# Altium schematic sheet MCU.SchDoc
size A4; SheetNumber: 1; SheetTotal: 4
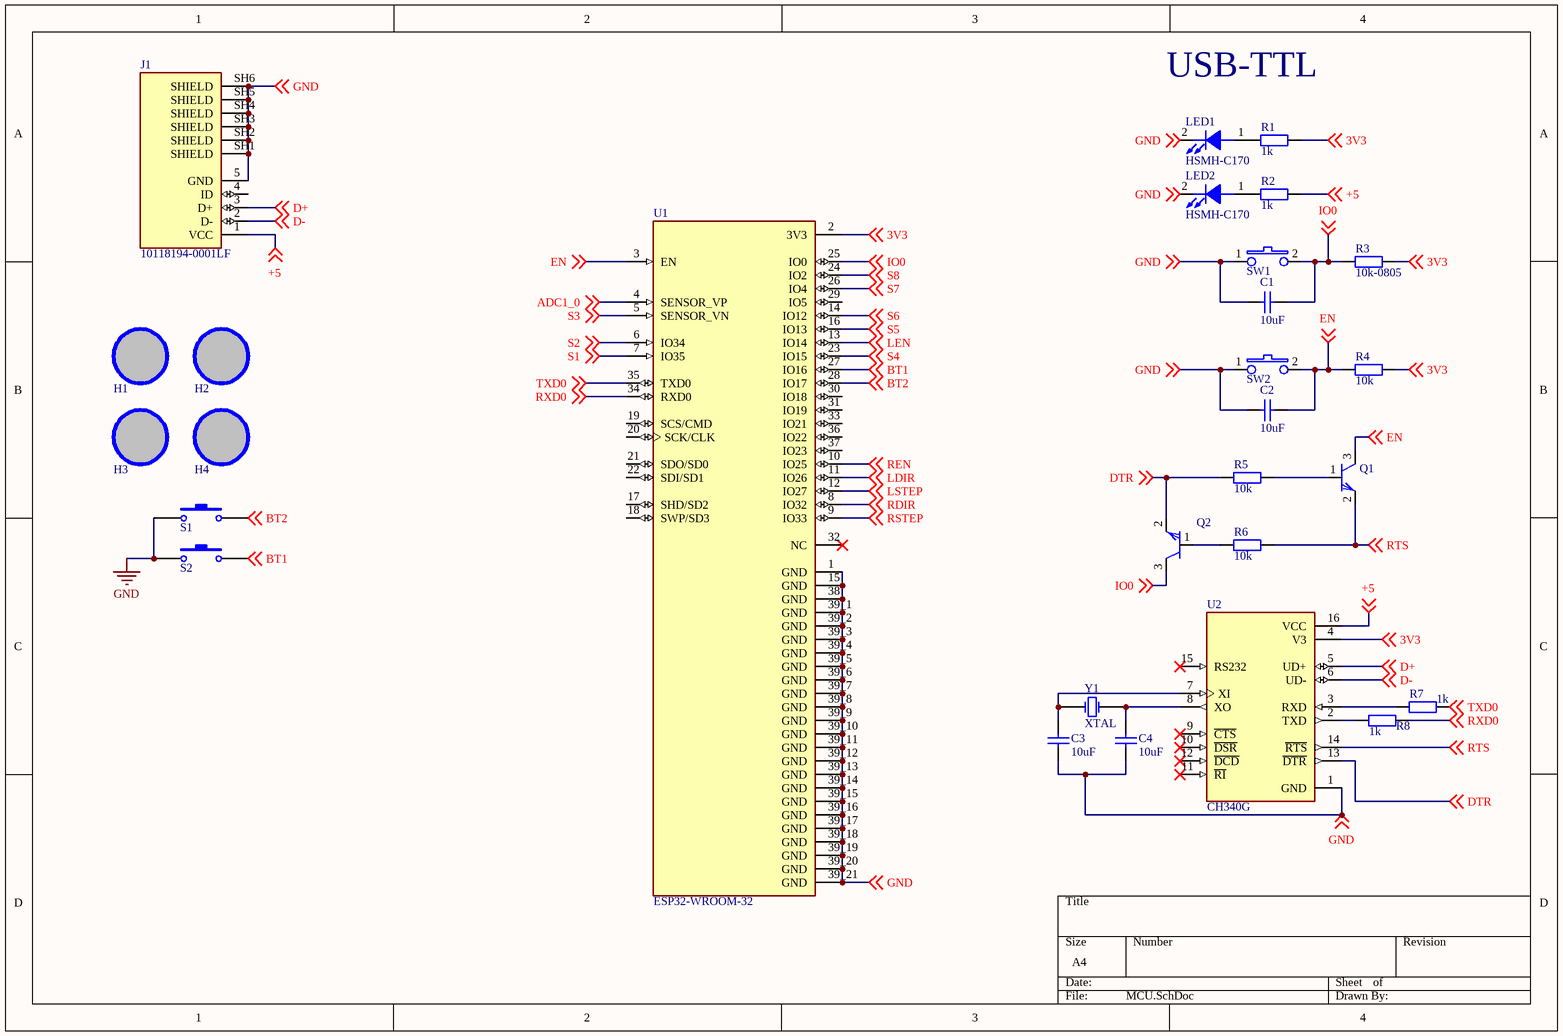
[diagram p0: MCU.SchDoc]

## Parts
C1  value 10uF  [C-NP-0805]  (hidden comment: Cap Non-pol)
C2  value 10uF  [C-NP-0805]  (hidden comment: Cap Non-pol)
C3  value 10uF  [C-NP-0805]  (hidden comment: Cap Non-pol)
C4  value 10uF  [C-NP-0805]  (hidden comment: Cap Non-pol)
H1  Hole  [LO KHOAN 3MM]  (value not drawn)
H2  Hole  [LO KHOAN 3MM]  (value not drawn)
H3  Hole  [LO KHOAN 3MM]  (value not drawn)
H4  Hole  [LO KHOAN 3MM]  (value not drawn)
J1  10118194-0001LF  [AMPHENOL_10118194-0001LF]
LED1  HSMH-C170  [LED.SMD.RED]
LED2  HSMH-C170  [LED.SMD.RED]
Q1  C1815  [SOT23N]  (value not drawn)
Q2  C1815  [SOT23N]  (value not drawn)
R1  value 1k  [DIEN TRO 0805]  (hidden comment: RES_SMD_0805)
R2  value 1k  [DIEN TRO 0805]  (hidden comment: RES_SMD_0805)
R3  value 10k-0805  [DIEN TRO 0805]  (hidden comment: RES_SMD_0805)
R4  value 10k  [DIEN TRO 0805]  (hidden comment: RES_SMD_0805)
R5  value 10k  [DIEN TRO 0805]  (hidden comment: RES_SMD_0805)
R6  value 10k  [DIEN TRO 0805]  (hidden comment: RES_SMD_0805)
R7  value 1k  [DIEN TRO 0805]  (hidden comment: RES_SMD_0805)
R8  value 1k  [DIEN TRO 0805]  (hidden comment: RES_SMD_0805)
S1  Tact SW - 2Pin  [SW2]  (value not drawn)
S2  Tact SW - 2Pin  [SW2]  (value not drawn)
SW1  PTS635  [TactSwitches.PTS635.SMT]  (value not drawn)
SW2  PTS635  [TactSwitches.PTS635.SMT]  (value not drawn)
U1  ESP32-WROOM-32  [MODULE_ESP32-WROOM-32]
U2  CH340G  [SOIC127P600X180-16N]
Y1  XTAL  [XTAL]

## Nets
GND: C1.1 C2.1 C3.1 C4.1 J1.5(GND) J1.SH1(SHIELD) J1.SH2(SHIELD) J1.SH3(SHIELD) J1.SH4(SHIELD) J1.SH5(SHIELD) J1.SH6(SHIELD) LED1.2(K) LED2.2(K) S1.1 S2.1 SW1.1 SW2.1 U1.1(GND) U1.15(GND) U1.38(GND) U1.39_1(GND) U1.39_2(GND) U1.39_3(GND) U1.39_4(GND) U1.39_5(GND) U1.39_6(GND) U1.39_7(GND) U1.39_8(GND) U1.39_9(GND) U1.39_10(GND) U1.39_11(GND) U1.39_12(GND) U1.39_13(GND) U1.39_14(GND) U1.39_15(GND) U1.39_16(GND) U1.39_17(GND) U1.39_18(GND) U1.39_19(GND) U1.39_20(GND) U1.39_21(GND) U2.1(GND) ; off-sheet GND
3V3: R1.2 R3.2 R4.2 U1.2(3V3) U2.4(V3) ; off-sheet 3V3
+5: J1.1(VCC) R2.2 U2.16(VCC) ; off-sheet +5
ADC1_0: U1.4(SENSOR_VP) ; off-sheet ADC1_0
BT1: S2.2 U1.27(IO16) ; off-sheet BT1
BT2: S1.2 U1.28(IO17) ; off-sheet BT2
D+: J1.3(D+) U2.5(UD+) ; off-sheet D+
D-: J1.2(D-) U2.6(UD-) ; off-sheet D-
DTR: Q2.2(E) R5.1 U2.13(~{DTR}) ; off-sheet DTR
EN: C2.2 Q1.3(C) R4.1 SW2.2 U1.3(EN) ; off-sheet EN
IO0: C1.2 Q2.3(C) R3.1 SW1.2 U1.25(IO0) ; off-sheet IO0
LDIR: U1.11(IO26) ; off-sheet LDIR
LEN: U1.13(IO14) ; off-sheet LEN
LSTEP: U1.12(IO27) ; off-sheet LSTEP
RDIR: U1.8(IO32) ; off-sheet RDIR
REN: U1.10(IO25) ; off-sheet REN
RSTEP: U1.9(IO33) ; off-sheet RSTEP
RTS: Q1.2(E) R6.2 U2.14(~{RTS}) ; off-sheet RTS
RXD0: R8.2 U1.34(RXD0) ; off-sheet RXD0
S1: U1.7(IO35) ; off-sheet S1
S2: U1.6(IO34) ; off-sheet S2
S3: U1.5(SENSOR_VN) ; off-sheet S3
S4: U1.23(IO15) ; off-sheet S4
S5: U1.16(IO13) ; off-sheet S5
S6: U1.14(IO12) ; off-sheet S6
S7: U1.26(IO4) ; off-sheet S7
S8: U1.24(IO2) ; off-sheet S8
TXD0: R7.2 U1.35(TXD0) ; off-sheet TXD0
NetC3_2: C3.2 U2.7(XI) Y1.2(OSC2)
NetC4_2: C4.2 U2.8(XO) Y1.1(OSC1)
NetLED1_1: LED1.1(A) R1.1
NetLED2_1: LED2.1(A) R2.1
NetQ1_1: Q1.1(B) R5.2
NetQ2_1: Q2.1(B) R6.1
NetR7_1: R7.1 U2.3(RXD)
NetR8_1: R8.1 U2.2(TXD)

Not connected (* = marked no-connect by the designer): H1 1; H2 1; H3 1; H4 1; J1 4(ID); U1 17(SHD/SD2) 18(SWP/SD3) 19(SCS/CMD) 20(SCK/CLK) 21(SDO/SD0) 22(SDI/SD1) 29(IO5) 30(IO18) 31(IO19) 32(NC)* 33(IO21) 36(IO22) 37(IO23); U2 9(~{CTS})* 10(~{DSR})* 11(~{RI})* 12(~{DCD})* 15(RS232)*

## Notes on the sheet
- USB-TTL

## Library data of the parts
C1-C4 = Cap Non-pol: Non-polarized Capacitor; Published: 8-Jun-2000; LatestRevisionDate: 17-Jul-2002; LatestRevisionNote: Re-released for DXP Platform.; PackageReference: RAD-0.3; Publisher: Altium Limited
H1-H4 = Hole: Hole 3mm
J1 = 10118194-0001LF: Micro USB, Input Output Connectors, B TYPE RECEPTACLE with flange; MF: Amphenol ICC; SnapEDA_Link: https://www.snapeda.com/parts/10118194-0001LF/Amphenol+FCI/view-part/?ref=snap; Package: None; Value: *; MP: 10118194-0001LF; Check_prices: https://www.snapeda.com/parts/10118194-0001LF/Amphenol+FCI/view-part/?ref=eda
LED1 LED2 = LED_1: Typical GaAs SMD LED; Manufacturer: Lite-On Inc; Color: RED; Type: Cong ty RP; Vendor: Digikey; Publisher: Hoang Nguyen; Price: *; Published: 13-April-2009; ComponentLink1Description: Digikey Part Link; ComponentLink2Description: Open Datasheet; ComponentLink2URL: H:\LIBRARY\LIBRARY.Datasheet\
Q1 Q2 = C1815: Q2SC1815; PSpiceTemplate: Q^@REFDES %c %b %e @MODEL; Vendor: Digikey; COMPONENT: 2SC1815; Published: 13-April-2009; Publisher: Hoang Nguyen; ComponentLink1Description: Digikey Part Link; ComponentLink2Description: Open Datasheet; ComponentLink2URL: H:\LIBRARY\LIBRARY.Datasheet\; Price: 500VND
R1-R8 = RES_SMD_0805: RES_0805; Published: 8-Jun-2000; LatestRevisionDate: 17-Jul-2002; LatestRevisionNote: Re-released for DXP Platform.; PackageReference: AXIAL-0.4; Publisher: Altium Limited
S1 S2 = Tact SW - 2Pin: Switch button 2 pin
SW1 SW2 = SW TACT MOM SPST: SWITCH TACT MOM SPST SMD; Manufacturer: C&K Components; Manufacturer P/N: PTS635SL25SMTR LFS; Vendor: Digikey; Vendor P/N: CKN9119CT-ND; ComponentLink1URL: http://search.digikey.com/scripts/DkSearch/dksus.dll?Detail&name=CKN1573CT-ND; ComponentLink2URL: H:\LIBRARY\LIBRARY.Datasheet\SBLCDA4_Specification.pdf; ComponentLink1Description: Digikey Part Link; ComponentLink2Description: Open Datasheet; Publisher: Hoang Nguyen; Published: 13-April-2009
U1 = ESP32-WROOM-32: Bluetooth, WiFi 802.11b/g/n, Bluetooth v4.2 +EDR, Class 1, 2 and 3 Transceiver Module 2.4GHz ~ 2.5GHz Antenna Not Included, U.FL Surface Mount; MF: Espressif Systems; Price: None; Availability: In Stock; MP: ESP32-WROOM-32; Package: Module Espressif Systems; SnapEDA_Link: https://www.snapeda.com/parts/ESP32-WROOM-32/Espressif+Systems/view-part/?ref=snap; Check_prices: https://www.snapeda.com/parts/ESP32-WROOM-32/Espressif+Systems/view-part/?ref=eda; Value: *; Purchase-URL: https://pricing.snapeda.com/search/part/ESP32-WROOM-32/?ref=eda
U2 = CH340G: USB Interface Integrated Circuit; MF: WCH; Value: *; SnapEDA_Link: https://www.snapeda.com/parts/Ch340G/WCH/view-part/?ref=snap; MP: Ch340G; Check_prices: https://www.snapeda.com/parts/Ch340G/WCH/view-part/?ref=eda; Availability: Not in stock; Price: None; Package: None
Y1 = XTAL: Crystal Oscillator; Published: 8-Jun-2000; LatestRevisionDate: 17-Jul-2002; LatestRevisionNote: Re-released for DXP Platform.; PackageReference: R38; Publisher: Altium Limited